# EAGLE schematic nano_carrier_th (EAGLE 9.6.2)
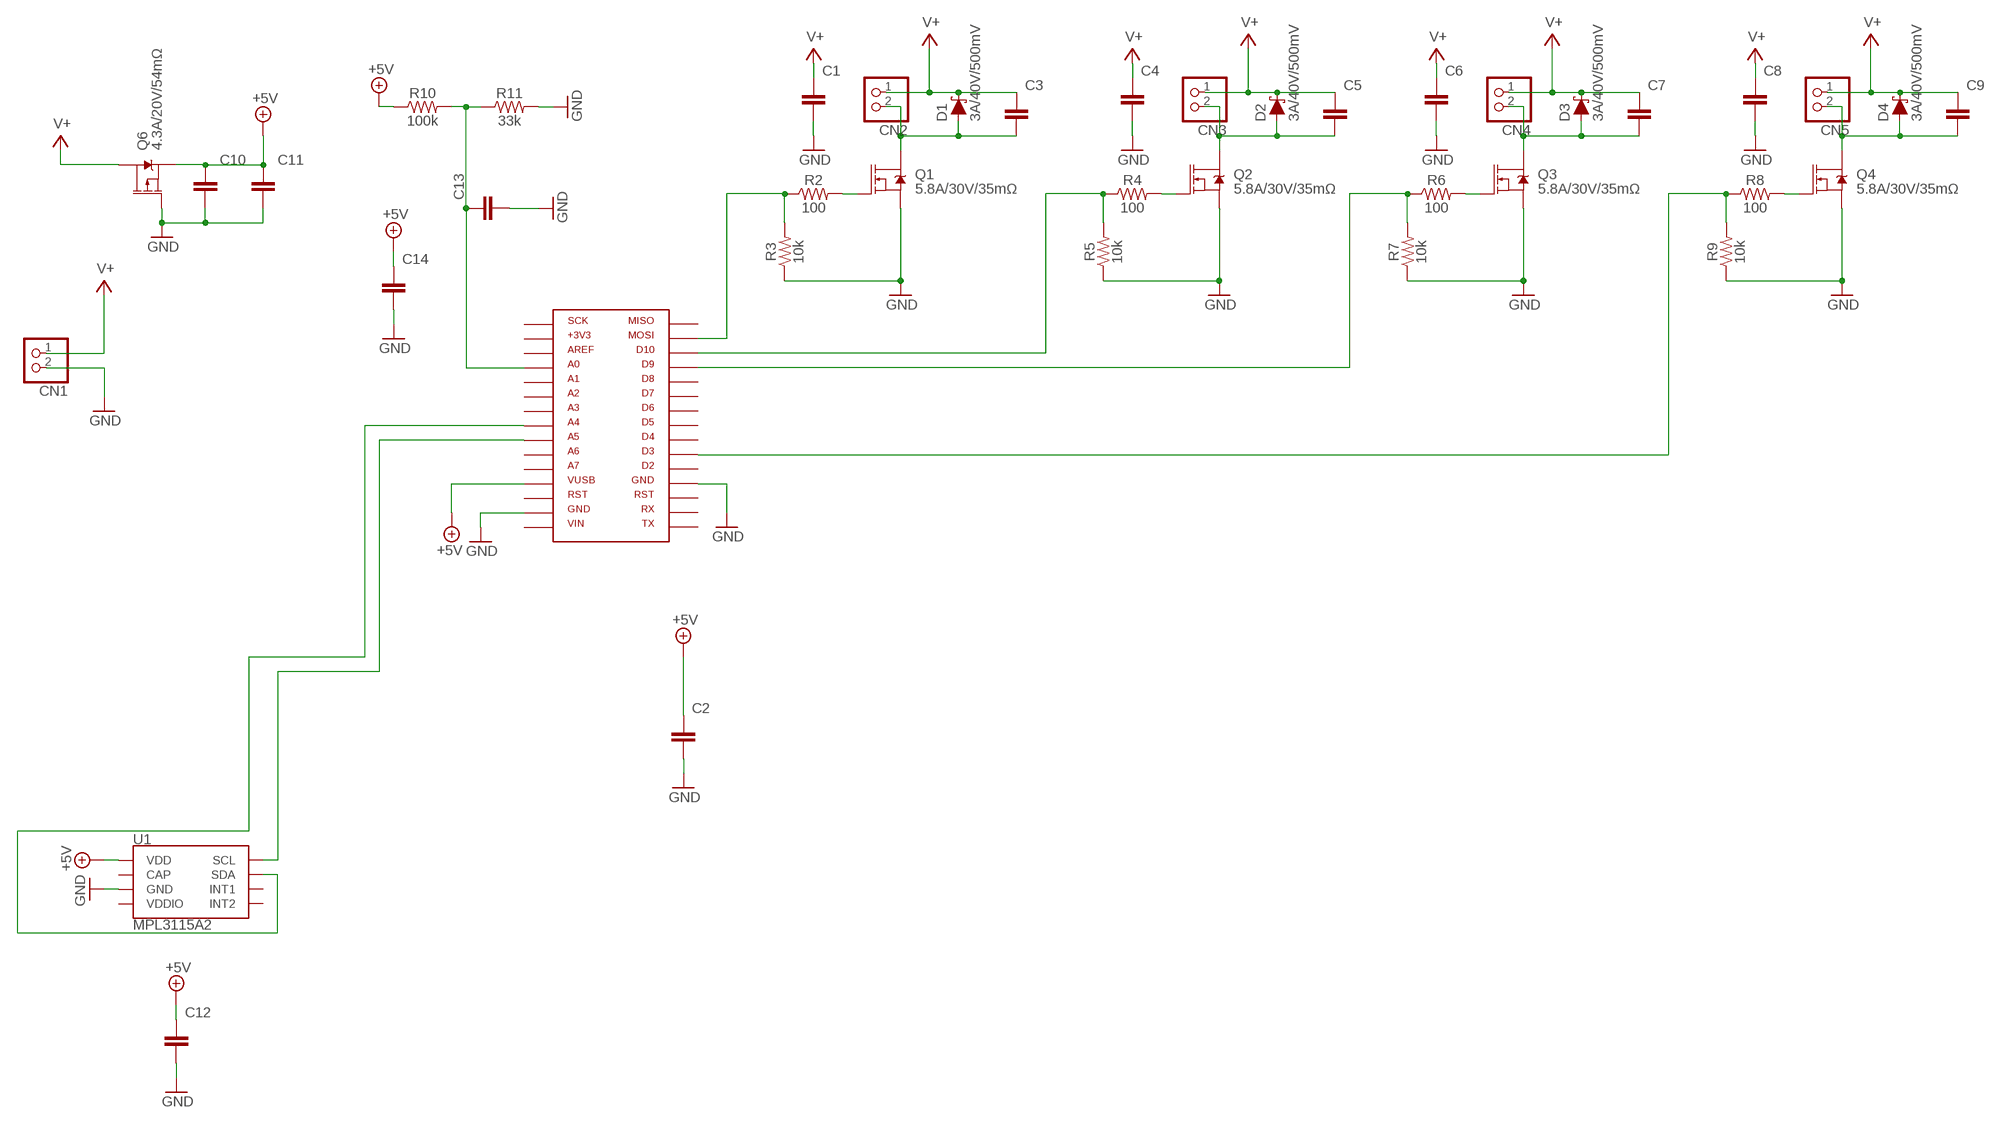
[diagram p0: schematic, sheet 1]

## Parts
C1  22uF  C_TANTALUM-1206(3216-METRIC)  [CAPM3216X180]
C2  10uF  C_TANTALUM-1206(3216-METRIC)  [CAPM3216X180]
C3  10nF  C_TANTALUM-1206(3216-METRIC)  [CAPM3216X180]
C4  22uF  C_TANTALUM-1206(3216-METRIC)  [CAPM3216X180]
C5  10nF  C_TANTALUM-1206(3216-METRIC)  [CAPM3216X180]
C6  22uF  C_TANTALUM-1206(3216-METRIC)  [CAPM3216X180]
C7  10nF  C_TANTALUM-1206(3216-METRIC)  [CAPM3216X180]
C8  22uF  C_TANTALUM-1206(3216-METRIC)  [CAPM3216X180]
C9  10nF  C_TANTALUM-1206(3216-METRIC)  [CAPM3216X180]
C10  C_TANTALUM-1206(3216-METRIC)  [CAPM3216X180]
C11  C_TANTALUM-1206(3216-METRIC)  [CAPM3216X180]
C12  22uF  C_TANTALUM-1206(3216-METRIC)  [CAPM3216X180]
C13  22uF  C_TANTALUM-1206(3216-METRIC)  [CAPM3216X180]
C14  22uF  C_TANTALUM-1206(3216-METRIC)  [CAPM3216X180]
CN1  JST_2PIN-THM  [JST-PH-2-THM]
CN2  JST_2PIN-THM  [JST-PH-2-THM]
CN3  JST_2PIN-THM  [JST-PH-2-THM]
CN4  JST_2PIN-THM  [JST-PH-2-THM]
CN5  JST_2PIN-THM  [JST-PH-2-THM]
D1  3A/40V/500mV  DIODE-SCHOTTKY-B340A  [SMA-DIODE]
D2  3A/40V/500mV  DIODE-SCHOTTKY-B340A  [SMA-DIODE]
D3  3A/40V/500mV  DIODE-SCHOTTKY-B340A  [SMA-DIODE]
D4  3A/40V/500mV  DIODE-SCHOTTKY-B340A  [SMA-DIODE]
Q1  5.8A/30V/35mΩ  MOSFET-NCH-AO3404A  [SOT23-3]
Q2  5.8A/30V/35mΩ  MOSFET-NCH-AO3404A  [SOT23-3]
Q3  5.8A/30V/35mΩ  MOSFET-NCH-AO3404A  [SOT23-3]
Q4  5.8A/30V/35mΩ  MOSFET-NCH-AO3404A  [SOT23-3]
Q6  4.3A/20V/54mΩ  MOSFET_PCH-IRLML2244  [SOT23-3]
R2  100  100OHM-0603-1/4W-5%  [0603]
R3  10k  10KOHM-0603-1/10W-1%  [0603]
R4  100  100OHM-0603-1/4W-5%  [0603]
R5  10k  10KOHM-0603-1/10W-1%  [0603]
R6  100  100OHM-0603-1/4W-5%  [0603]
R7  10k  10KOHM-0603-1/10W-1%  [0603]
R8  100  100OHM-0603-1/4W-5%  [0603]
R9  10k  10KOHM-0603-1/10W-1%  [0603]
R10  100k  100KOHM-0603-1/10W-1%  [0603]
R11  33k  33KOHM-0603-1/10W-1%  [0603]
U1  MPL3115A2  [LGA-8-5X3]
U$1  NANO-TH  [NANO-TH]

## Nets
+5V: C2.1 C10.1 C11.1 C12.1 C14.1 Q6.2(S) R10.1 U1.1(VDD) U$1.P$12
GND: C1.2 C2.2 C4.2 C6.2 C8.2 C10.2 C11.2 C12.2 C13.2 C14.2 CN1.2 Q1.2(S) Q2.2(S) Q3.2(S) Q4.2(S) Q6.1(G) R3.1 R5.1 R7.1 R9.1 R11.2 U1.3(GND) U$1.P$14 U$1.P$19
N$2: R2.1 R3.2 U$1.P$29
N$3: Q1.1(G) R2.2
N$4: C3.2 CN2.2 D1.A Q1.3(D)
N$5: R4.1 R5.2 U$1.P$28
N$6: Q2.1(G) R4.2
N$7: C5.2 CN3.2 D2.A Q2.3(D)
N$8: R6.1 R7.2 U$1.P$27
N$9: Q3.1(G) R6.2
N$10: C7.2 CN4.2 D3.A Q3.3(D)
N$11: R8.1 R9.2 U$1.P$21
N$12: Q4.1(G) R8.2
N$13: C9.2 CN5.2 D4.A Q4.3(D)
N$14: U1.8(SCL) U$1.P$9
N$15: U1.7(SDA) U$1.P$8
N$16: C13.1 R10.2 R11.1 U$1.P$4
V+: C1.1 C3.1 C4.1 C5.1 C6.1 C7.1 C8.1 C9.1 CN1.1 CN2.1 CN3.1 CN4.1 CN5.1 D1.C D2.C D3.C D4.C Q6.3(D)
Unconnected: U1.5(INT2) U1.6(INT1) U$1.P$1 U$1.P$2 U$1.P$3 U$1.P$5 U$1.P$6 U$1.P$7 U$1.P$10 U$1.P$11 U$1.P$13 U$1.P$15 U$1.P$16 U$1.P$17 U$1.P$18 U$1.P$20 U$1.P$22 U$1.P$23 U$1.P$24 U$1.P$25 U$1.P$26 U$1.P$30

## Power pins joined to a net without a drawn wire
CAP: U1.2(CAP)
VDDIO: U1.4(VDDIO)

## Library data of the parts
C1-C14 = Capacitor:C: Capacitor - Generic; CATEGORY: Capacitor
CN1-CN5 = adafruit:JST_2PIN: JST 2-Pin Connectors of various flavors SMT-RA (S2B-PH-SM4) 4UConnector #17311 SMT (B2B-PH-SM4) THM-RA (S2B-PH) THM (B2B-PH)
D1-D4 = SparkFun-DiscreteSemi:DIODE-SCHOTTKY: Schottky diode A Schottky diode is a semiconductor diode which has a low forward voltage drop and a very fast switching action.; PROD_ID: DIO-09886
Q1-Q4 = SparkFun-DiscreteSemi:MOSFET-NCH: N-channel MOSFETs Voltage controlled devices that allow control of high current outputs. SparkFun Products: SparkFun OpenScale <https://www.sparkfun.com/products/13261> SparkFun Digital Sandbox <https://www.sparkfun.com/products/12651> SparkFun Monster Moto Shield <https://www.sparkfun.com/products/10182> SparkFun MOSFET Power Controller <https://www.sparkfun.com/products/11214>; PROD_ID: TRANS-12988
Q6 = SparkFun-DiscreteSemi:MOSFET_PCH: P-channel MOSFETs Voltage controlled devices that allow control of high current outputs. SparkFun Products: SparkFun ESP32 Thing <https://www.sparkfun.com/products/13907> SparkFun ESP8266 Thing <https://www.sparkfun.com/products/13231>; PROD_ID: TRANS-11153
R2 R4 R6 R8 = SparkFun-Resistors:100OHM: 100Ω resistor A resistor is a passive two-terminal electrical component that implements electrical resistance as a circuit element. Resistors act to reduce current flow, and, at the same time, act to lower voltage levels within circuits. - Wikipedia; PROD_ID: RES-12438
R3 R5 R7 R9 = SparkFun-Resistors:10KOHM: 10kΩ resistor A resistor is a passive two-terminal electrical component that implements electrical resistance as a circuit element. Resistors act to reduce current flow, and, at the same time, act to lower voltage levels within circuits. - Wikipedia; PROD_ID: RES-00824
R10 = SparkFun-Resistors:100KOHM: 100kΩ resistor A resistor is a passive two-terminal electrical component that implements electrical resistance as a circuit element. Resistors act to reduce current flow, and, at the same time, act to lower voltage levels within circuits. - Wikipedia; PROD_ID: RES-07828
R11 = SparkFun-Resistors:33KOHM: 33kΩ resistor A resistor is a passive two-terminal electrical component that implements electrical resistance as a circuit element. Resistors act to reduce current flow, and, at the same time, act to lower voltage levels within circuits. - Wikipedia; PROD_ID: RES-08416
U1 = SparkFun-Sensors:MPL3115A2: NXP MPL3115A2 Digital Altimeter/Pressure Sensor The MPL3115A2 is a compact piezoresistive absolute pressure sensor with an I2C interface. MPL3115 has a wide operating range of 20kPa to 110 kPa, a range that covers all surface elevations on Earth. The fully internally compensated MEMS in conjunction with an embedded high resolution 24-bit equivalent ADC provide accurate pressure [Pascals] /altitude [meters] and temperature [degrees Celsius] data. Datasheet <http://cdn.sparkfun.com/datasheets/Sensors/Pressure/MPL3115A2.pdf> SparkFun Products SparkFun Altitude/Pressure Sensor Breakout - MPL3115A2 <https://www.sparkfun.com/products/11084> (SEN-11084) SparkFun Weather Shield <https://www.sparkfun.com/products/12081> (DEV-12081) SparkFun Photon Weather Shield <https://www.sparkfun.com/products/13630> (DEV-13630); PROD_ID: IC-10869
U$1 = Arduino-headers:NANO-TH